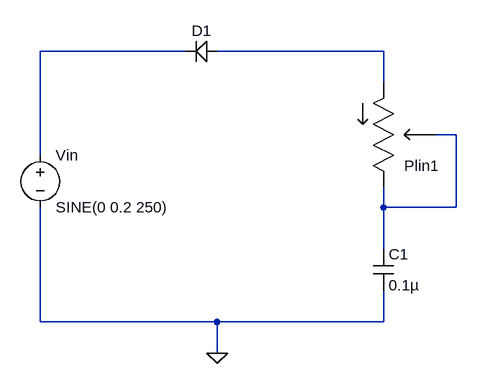
[diagram p0: schematic DEMO.asc]
DEMO.asc, the LTspice schematic file:
Version 4
SHEET 1 880 680
WIRE 128 0 -96 0
WIRE 432 0 176 0
WIRE 432 48 432 0
WIRE 544 128 512 128
WIRE -96 160 -96 0
WIRE 432 240 432 208
WIRE 544 240 544 128
WIRE 544 240 432 240
WIRE 432 304 432 240
WIRE -96 416 -96 240
WIRE 176 416 -96 416
WIRE 432 416 432 368
WIRE 432 416 176 416
WIRE 176 464 176 416
FLAG 176 464 0
SYMBOL voltage -96 144 R0
SYMATTR InstName Vin
SYMATTR Value SINE(0 0.2 250)
SYMBOL ExtendedSchockleyDiode 176 -16 R90
WINDOW 0 0 24 VBottom 2
SYMATTR InstName D1
SYMATTR SpiceLine Is=4.352n eta=1.905 Vth=25.8563m Rs=1m Rp=1Meg
SYMBOL LinearPotentiometer 432 128 R0
SYMATTR InstName Plin1
SYMATTR SpiceLine Rp=100k x=0.5
SYMBOL cap 416 304 R0
SYMATTR InstName C1
SYMATTR Value 0.1µ

The netlist it stands for:
* DEMO.asc
Vin N001 0 SINE(0 0.2 250)
XD1 N002 N001 ExtendedSchockleyDiode Is=4.352n eta=1.905 Vth=25.8563m Rs=1m Rp=1Meg  ; pins 1 2
XPlin1 N002 N003 N003 LinearPotentiometer Rp=100k x=0.5  ; pins 1 2 3
C1 N003 0 0.1µ
.backanno
.end